# EAGLE design codec (EAGLE 7.5.0)
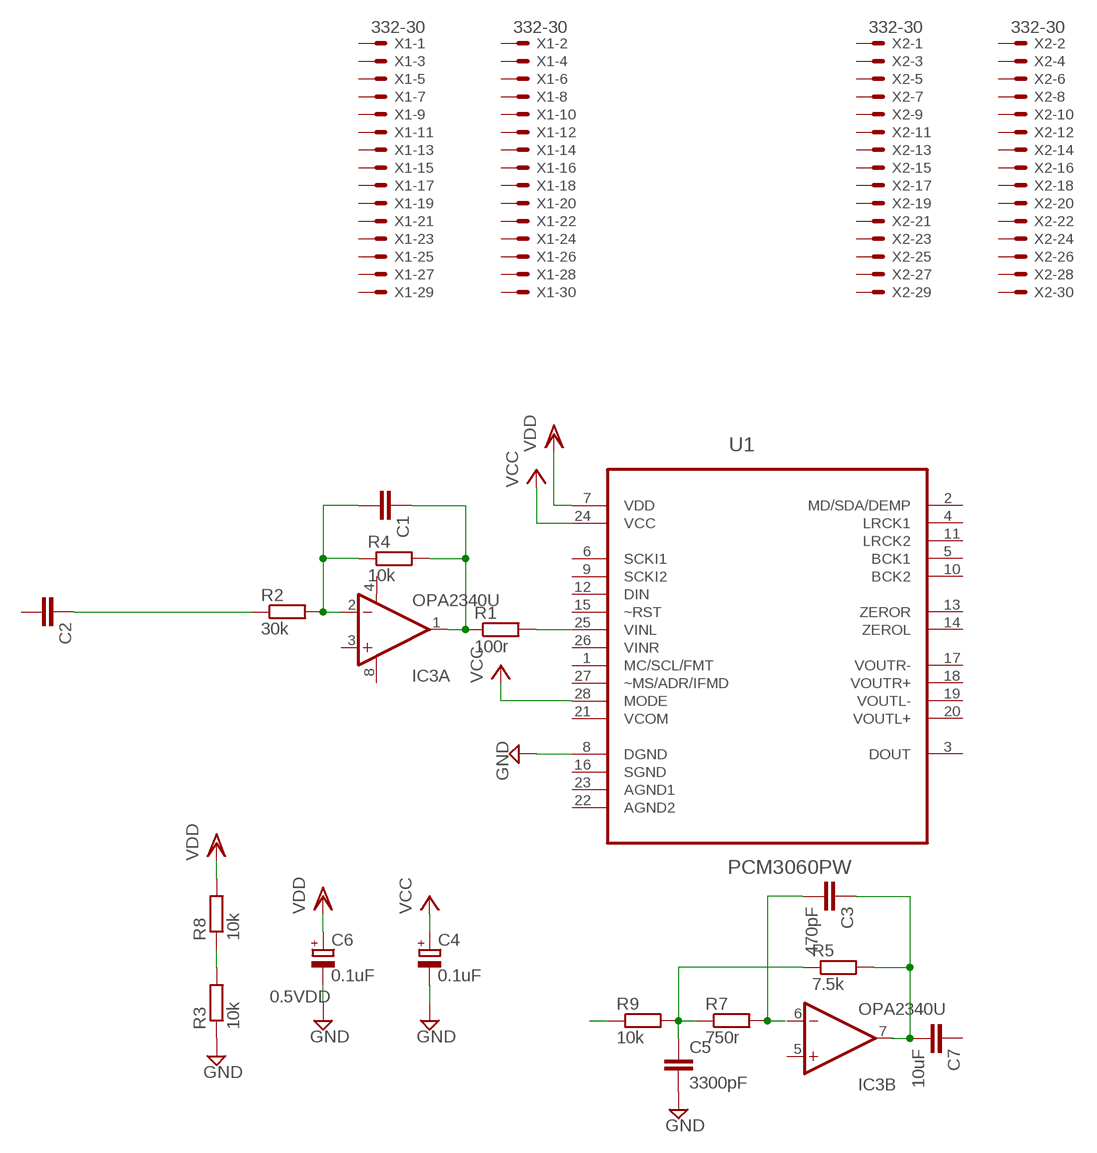
[diagram p0: schematic, sheet 1]

## Parts
C1  C-EUC1608  [C1608]
C2  C-EUC1608  [C1608]
C3  470pF  C-EUC1608  [C1608]
C4  0.1uF  CPOL-EU150CLZ-1010  [150CLZ-1010]
C5  3300pF  C-EUC1608  [C1608]
C6  0.1uF  CPOL-EU150CLZ-1010  [150CLZ-1010]
C7  10uF  C-EUC1608  [C1608]
IC3  OPA2340U  [SO08]
R1  100r  R-EU_R1206  [R1206]
R2  30k  R-EU_R1206  [R1206]
R3  10k  R-EU_R1206  [R1206]
R4  10k  R-EU_R1206  [R1206]
R5  7.5k  R-EU_R1206  [R1206]
R7  750r  R-EU_R1206  [R1206]
R8  10k  R-EU_R1206  [R1206]
R9  10k  R-EU_R1206  [R1206]
U1  PCM3060PW  [SOP65P640X120-28N]
X1  332-30  [332-30]
X2  332-30  [332-30]

## Nets
0.5VDD: R3.2 R8.1
GND: C4.- C5.2 C6.- R3.1 U1.8(DGND)
N$1: C1.1 IC3.1(A:OUT) R1.1 R4.2
N$2: C2.1 R2.1
N$3: C1.2 IC3.2(A:-IN) R2.2 R4.1
N$4: C3.1 C7.2 IC3.7(B:OUT) R5.2
N$5: R9.1
N$6: C3.2 R7.2
N$7: C5.1 R5.1 R7.1 R9.2
N$8: R1.2 U1.25(VINL)
VCC: C4.+ U1.24(VCC) U1.28(MODE)
VDD: C6.+ R8.2 U1.7(VDD)
Unconnected: C2.2 C7.1 IC3.3(A:+IN) IC3.5(B:+IN) IC3.6(B:-IN) U1.1(MC/SCL/FMT) U1.2(MD/SDA/DEMP) U1.3(DOUT) U1.4(LRCK1) U1.5(BCK1) U1.6(SCKI1) U1.9(SCKI2) U1.10(BCK2) U1.11(LRCK2) U1.12(DIN) U1.13(ZEROR) U1.14(ZEROL) U1.15(~RST) U1.16(SGND) U1.17(VOUTR-) U1.18(VOUTR+) U1.19(VOUTL-) U1.20(VOUTL+) U1.21(VCOM) U1.22(AGND2) U1.23(AGND1) U1.26(VINR) U1.27(~MS/ADR/IFMD) X1.1 X1.2 X1.3 X1.4 X1.5 X1.6 X1.7 X1.8 X1.9 X1.10 X1.11 X1.12 X1.13 X1.14 X1.15 X1.16 X1.17 X1.18 X1.19 X1.20 X1.21 X1.22 X1.23 X1.24 X1.25 X1.26 X1.27 X1.28 X1.29 X1.30 X2.1 X2.2 X2.3 X2.4 X2.5 X2.6 X2.7 X2.8 X2.9 X2.10 X2.11 X2.12 X2.13 X2.14 X2.15 X2.16 X2.17 X2.18 X2.19 X2.20 X2.21 X2.22 X2.23 X2.24 X2.25 X2.26 X2.27 X2.28 X2.29 X2.30

## Power pins joined to a net without a drawn wire
V+: IC3.8(A:V+)
V-: IC3.4(A:V-)

## Library data of the parts
C1-C3 C5 C7 = rcl:C-EU: CAPACITOR, European symbol
C4 C6 = rcl:CPOL-EU: POLARIZED CAPACITOR, European symbol
IC3 = burr-brown:OPA2340: Single-Supply, Rail-to-Rail Operational Amplifiers MicroAmplifier(TM) Series; Product Folder:OPA2340; MF: TEXAS INSTRUMENTS; MPN: OPA2340UA; OC_FARNELL: 1101541; OC_NEWARK: 36K7581
R1-R5 R7-R9 = rcl:R-EU_: RESISTOR, European symbol
U1 = ti-codec:PCM3060PW: ASYNCHRONOUS STEREO AUDIO CODEC; MPN: PCM3060PW; OC_FARNELL: 1390706; OC_NEWARK: 36M9294; PACKAGE: TSSOP-28; SUPPLIER: Texas Instruments
X1 X2 = con-garry:332-30: 30 Pin - 2mm Dual Row Source: www.mpe-connector.de / garry_shortform_2012.pdf

## Board
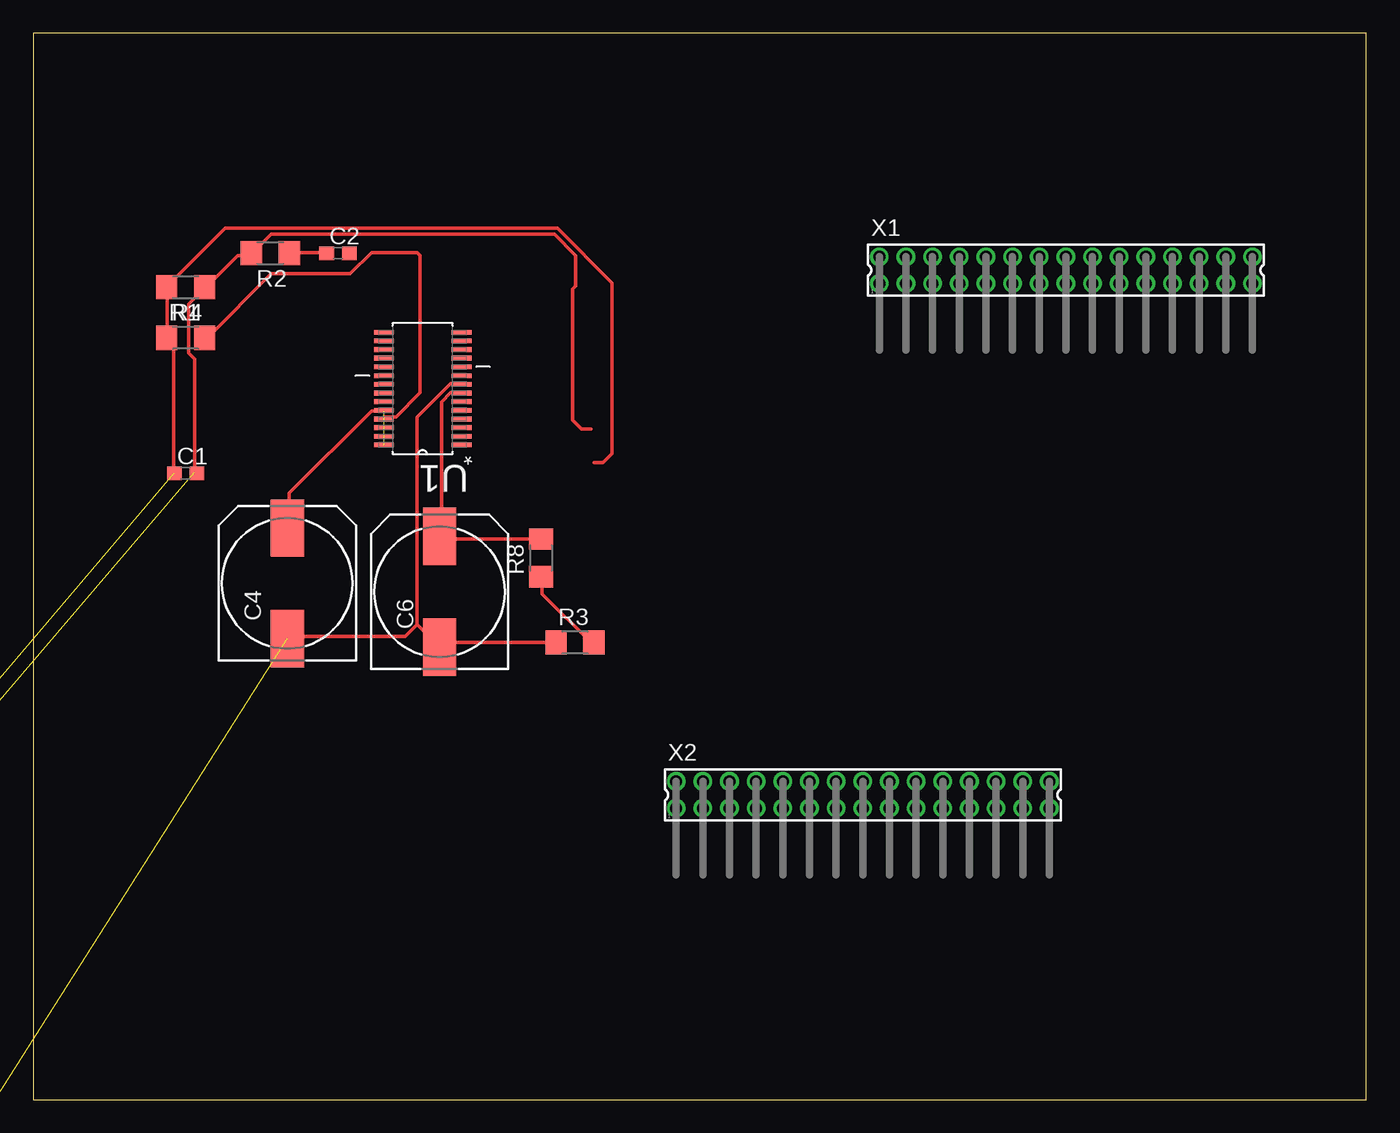
[diagram p1: board, top side]

Size 100 x 80 mm. Coordinates in mm from the lower left corner, seen from the top.
Outline: 0,0 100,0 100,80 0,80 0,0
Copper layers (1*16): Top 0.035mm / dielectric 1.5mm / Bottom 0.035mm
Design rules "default": minimum track width 10mil, minimum drill 24mil, track to track 8mil, track to pad 8mil, pad to pad 8mil, via to via 8mil, smd to smd 8mil, copper to edge 40mil, drill to drill 8mil, minimum pad ring 10mil, minimum via ring 8mil, stop-mask expansion 4mil, vias tented up to drill 0mil, thermal gap 10mil

### Footprints (pad centres in the part's own frame; a part is rotated, then mirrored left to right if it is on the bottom)
C1608 = smd 1.1 x 1: 1 -0.85,0; 2 0.85,0
150CLZ-1010 = smd 4.3 x 2.5: + 4.15,0; - -4.15,0
SO08 = smd 0.61 x 2.21: 1 -1.905,-2.616; 2 -0.635,-2.616; 3 0.635,-2.616; 4 1.905,-2.616; 5 1.905,2.616; 6 0.635,2.616; 7 -0.635,2.616; 8 -1.905,2.616
R1206 = smd 1.6 x 1.803: 1 -1.422,0; 2 1.422,0
SOP65P640X120-28N = smd 1.473 x 0.356: 1 -2.921,4.216; 2 -2.921,3.581; 3 -2.921,2.921; 4 -2.921,2.286; 5 -2.921,1.626; 6 -2.921,0.965; 7 -2.921,0.33; 8 -2.921,-0.33; 9 -2.921,-0.965; 10 -2.921,-1.626; 11 -2.921,-2.286; 12 -2.921,-2.921; 13 -2.921,-3.581; 14 -2.921,-4.216; 15 2.921,-4.216; 16 2.921,-3.581; 17 2.921,-2.921; 18 2.921,-2.286; 19 2.921,-1.626; 20 2.921,-0.965; 21 2.921,-0.33; 22 2.921,0.33; 23 2.921,0.965; 24 2.921,1.626; 25 2.921,2.286; 26 2.921,2.921; 27 2.921,3.581; 28 2.921,4.216
332-30 = drill 0.9 pad 1.27: 1 -14,-1; 2 -14,1; 3 -12,-1; 4 -12,1; 5 -10,-1; 6 -10,1; 7 -8,-1; 8 -8,1; 9 -6,-1; 10 -6,1; 11 -4,-1; 12 -4,1; 13 -2,-1; 14 -2,1; 15 0,-1; 16 0,1; 17 2,-1; 18 2,1; 19 4,-1; 20 4,1; 21 6,-1; 22 6,1; 23 8,-1; 24 8,1; 25 10,-1; 26 10,1; 27 12,-1; 28 12,1; 29 14,-1; 30 14,1

### Placement (x,y rotation side)
C1  11.43,46.99 0 top
C2  22.86,63.5 0 top
C3  -16.51,-13.97 0 top  (outside the outline)
C4  19.05,38.73 90 top
C5  -27.94,-38.1 0 top  (outside the outline)
C6  30.48,38.1 90 top
C7  -27.94,-33.02 0 top  (outside the outline)
IC3  -25.4,5.08 0 top  (outside the outline)
R1  11.43,57.15 0 top
R2  17.78,63.5 180 top
R3  40.64,34.29 0 top
R4  11.43,60.96 180 top
R5  -26.67,-15.24 0 top  (outside the outline)
R7  -21.59,-15.24 0 top  (outside the outline)
R8  38.1,40.64 90 top
R9  -26.67,-26.67 0 top  (outside the outline)
U1  29.21,53.34 180 top
X1  77.47,62.23 0 top
X2  62.23,22.86 0 top

### Tracks (layer width: path | path; a pad name or v marks a point on that pad's centre or on a via)
0.5VDD
  Top 0.254: R8.1 38.18,39.09 38.18,37.95 41.83,34.29 R3.2
GND  (1 unrouted)
  Top 0.254: 28.8,35.66 28.8,51.21 31.32,53.72 32,53.72 U1.8 | 28.8,35.66 30.4,34.06 C6.- 30.63,34.06 30.86,34.29 R3.1 | 28.8,35.66 27.89,34.75 19.2,34.75 C4.-
N$1  (1 unrouted)
  Top 0.254: 10.06,57.15 10.06,60.81 R4.2 10.06,61.04 14.4,65.38 39.32,65.38 43.43,61.27 43.43,48.46 42.75,47.78 42.06,47.78 | 10.06,57.15 10.52,56.69 10.52,47.09 C1.1 | 10.06,57.15 R1.1
N$2
  Top 0.254: C2.1 21.95,63.55 19.2,63.55 R2.1
N$3  (1 unrouted)
  Top 0.254: C1.2 12.12,47.09 12.12,55.55 11.66,56.01 11.66,59.66 12.8,60.81 R4.1 13.03,61.04 15.32,63.32 16.23,63.32 R2.2 16.46,63.55 17.83,64.92 39.09,64.92 40.69,63.32 40.69,61.04 40.46,60.81 40.46,50.98 41.15,50.29 41.83,50.29
N$4  (3 unrouted)
N$6  (1 unrouted)
N$7  (3 unrouted)
N$8
  Top 0.254: U1.25 26.29,51.21 27.2,51.21 29.03,53.03 29.03,63.32 28.8,63.55 25.38,63.55 23.77,61.95 17.83,61.95 13.03,57.15 R1.2
VCC  (1 unrouted)
  Top 0.254: U1.24 26.29,51.66 25.38,51.66 19.2,45.49 19.2,42.98 C4.+
VDD
  Top 0.254: U1.7 32,53.03 31.32,53.03 30.63,52.35 30.63,42.29 C6.+ 30.63,42.06 37.95,42.06 R8.2